# EAGLE design SparkFun_IR_Receiver (EAGLE 7.2.0)
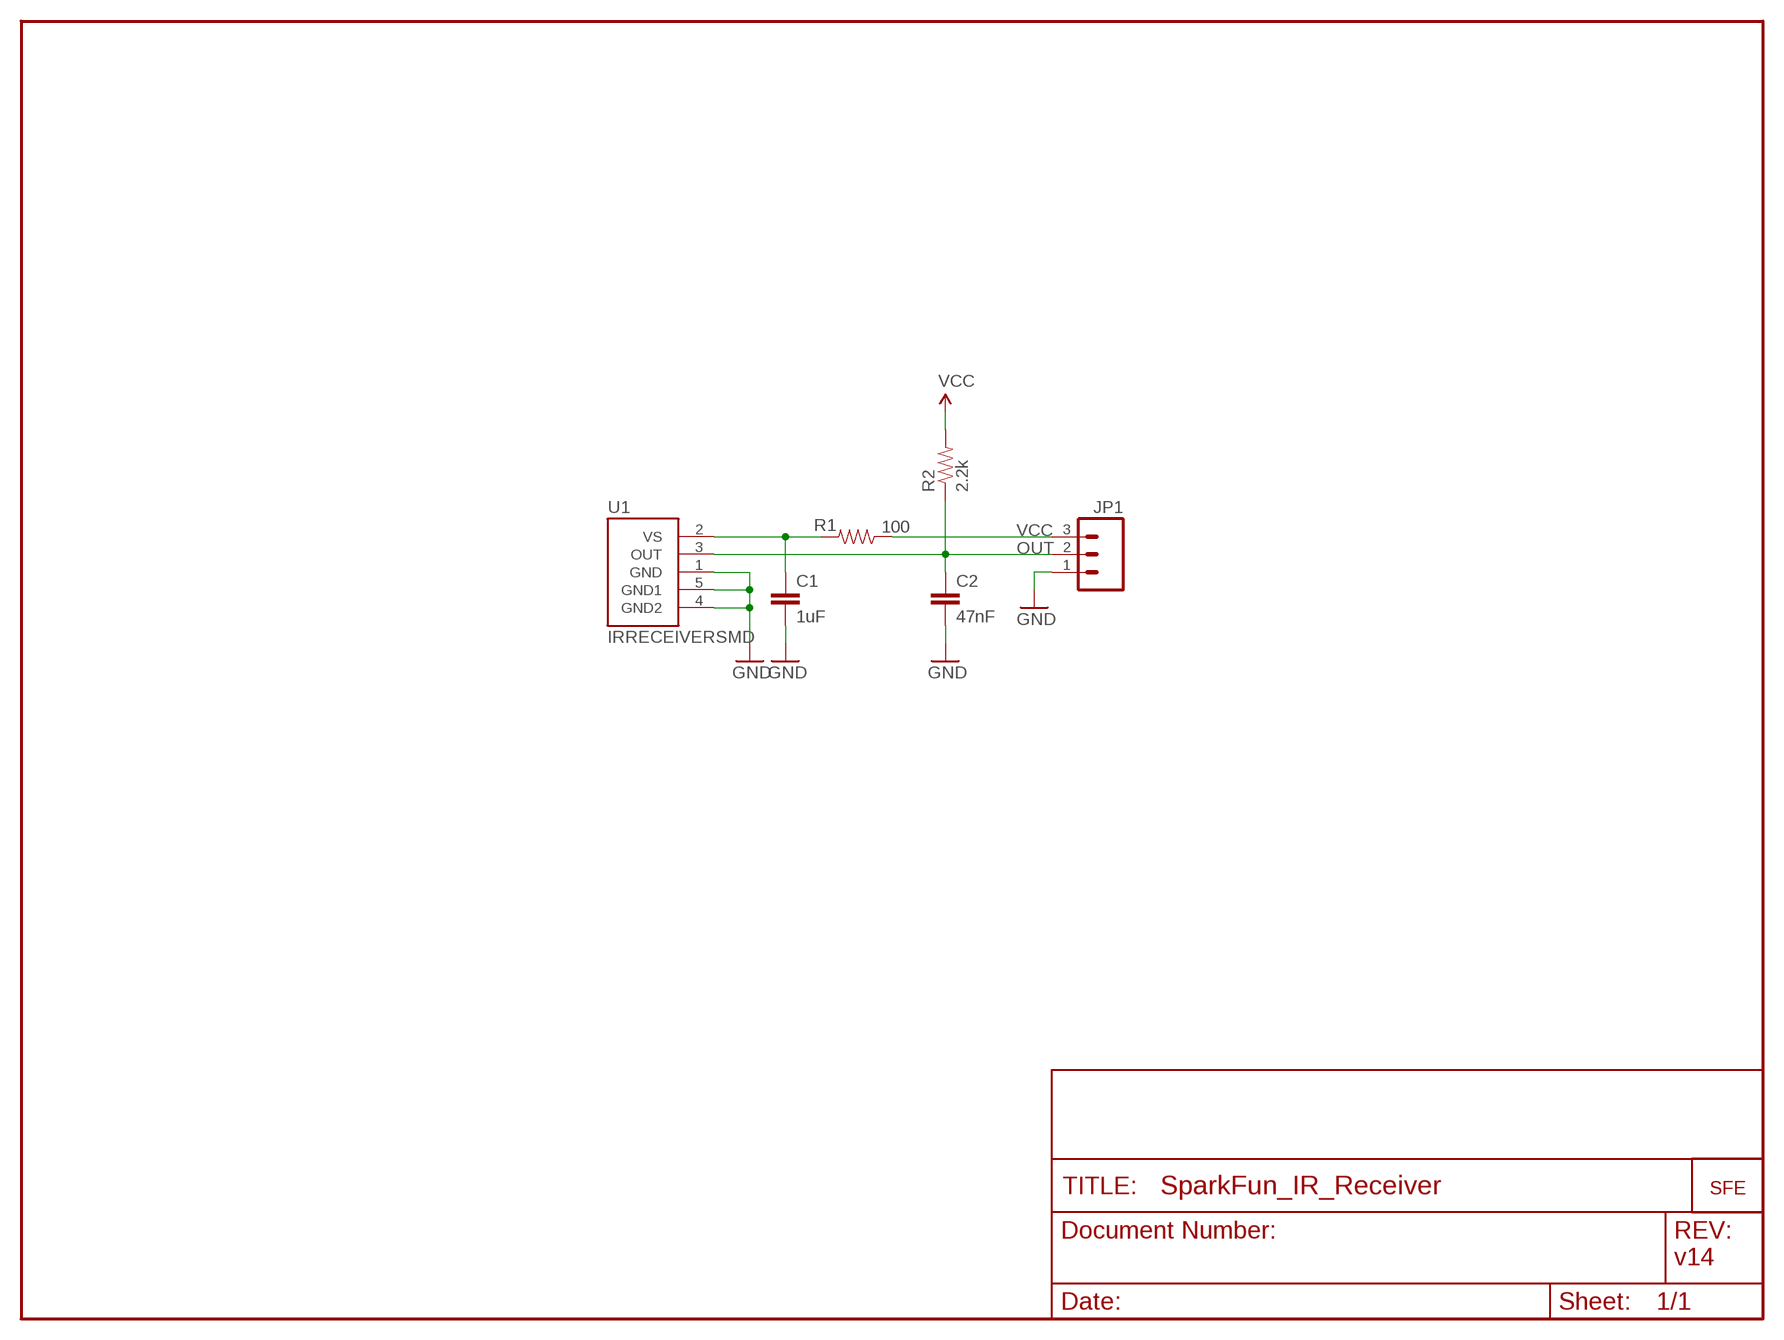
[diagram p0: schematic, sheet 1]

## Parts
C1  1uF  CAP0603-CAP  [0603-CAP]
C2  47nF  CAP0603-CAP  [0603-CAP]
JP1  M03PTH  [1X03]
R1  100  RESISTOR0603-RES  [0603-RES]
R2  2.2k  RESISTOR0603-RES  [0603-RES]
U1  IRRECEIVERSMD  [TSOP8523]
U$1  LOGO-SFESK  [SFE-LOGO-FLAME]

## Nets
GND: C1.2 C2.2 JP1.1 U1.1(GND) U1.4(GND2) U1.5(GND1)
OUT: C2.1 JP1.2 R2.1 U1.3(OUT)
VCC: JP1.3 R1.1 R2.2
VS: C1.1 R1.2 U1.2(VS)

## Notes on the sheet
- v14

## Library data of the parts
C1 C2 = SparkFun:CAP: Capacitor Standard 0603 ceramic capacitor, and 0.1" leaded capacitor.
JP1 = SparkFun:M03: Header 3 Standard 3-pin 0.1" header. Use with straight break away headers (SKU : PRT-00116), right angle break away headers (PRT-00553), swiss pins (PRT-00743), machine pins (PRT-00117), and female headers (PRT-00115). Molex polarized connector foot print use with SKU : PRT-08232 with associated crimp pins and housings.
R1 R2 = SparkFun:RESISTOR: Resistor Basic schematic elements and footprints for 0603, 1206, and PTH 1/10th watt (small) resistors.
U1 = SparkFun:IRRECEIVER: Description: IR receiver with built in demodulation and filtering. SparkFun SKU: SEN-08545
U$1 = SparkFun:LOGO-SFE: Spark Fun Electronics PCB Logo This is the standard Spark Fun Electronics PCB logo.

## Board
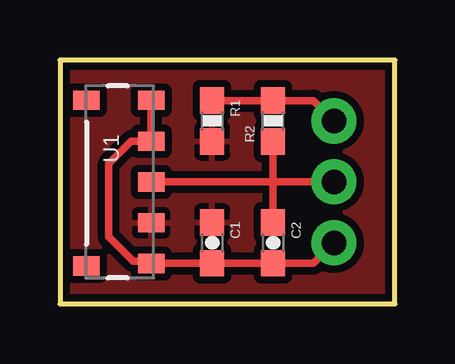
[diagram p1: board, top side]
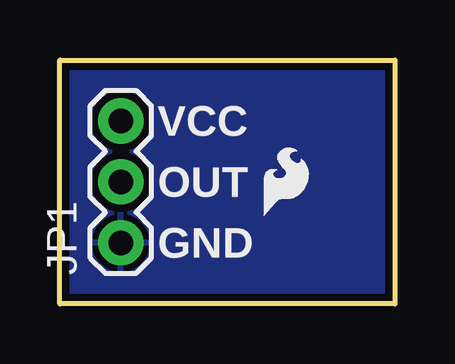
[diagram p2: board, bottom side, seen from below]

Size 13.97 x 10.16 mm. Coordinates in mm from the lower left corner, seen from the top.
Outline: 0,0 13.97,0 13.97,10.16 0,10.16 0,0
Copper layers (1*16): Top 0.035mm / dielectric 1.5mm / Bottom 0.035mm
Design rules "SparkFun": minimum track width 8mil, minimum drill 20mil, track to track 8mil, track to pad 8mil, pad to pad 8mil, via to via 8mil, smd to smd 8mil, copper to edge 8mil, drill to drill 8mil, minimum pad ring 12mil, minimum via ring 10mil, stop-mask expansion 4mil, vias tented up to drill 20mil, thermal gap 10mil

### Footprints (pad centres in the part's own frame; a part is rotated, then mirrored left to right if it is on the bottom)
0603-CAP = smd 1.1 x 1: 1 -0.85,0; 2 0.85,0
1X03 = drill 1.016 pad 1.88: 1 0,0; 2 2.54,0; 3 5.08,0
0603-RES = smd 1.1 x 1: 1 -0.85,0; 2 0.85,0
TSOP8523 = smd 0.8 x 1.1: 1 3.4,0; 2 1.7,0; 3 0,0; 4 -1.7,0; 5 -3.4,0; P$1 -3.4,-2.7; P$2 3.5,-2.7

### Placement (x,y rotation side)
C1  6.35,2.54 270 top
C2  8.89,2.54 270 top
JP1  11.43,2.54 90 bottom
R1  6.35,7.62 270 top
R2  8.89,7.62 90 top
U1  3.81,5.08 270 top
U$1  5.46,3.68 0 bottom

### Tracks (layer width: path | path; a pad name or v marks a point on that pad's centre or on a via)
GND
  Top 0.203: U1.1 3.81,1.78
  Top 0.305: U1.1 C1.2 C2.2 10.58,1.69 JP1.1 | 3.81,1.78 3.05,1.78 2.03,2.79 2.03,5.84 2.97,6.78 U1.4 U1.5
  pour Bottom (isolate 0.305): 0,10.16 0,0 13.97,0 13.97,10.16
OUT
  Top 0.203: C2.1 8.89,3.3
  Top 0.305: 8.89,5.08 C2.1 | 8.89,5.08 JP1.2 | 8.89,5.08 R2.1 | U1.3 8.89,5.08
VCC
  Top 0.305: R1.1 R2.2 10.58,8.47 JP1.3
VS
  pour Top (isolate 0.305): 0,10.16 0,0 13.97,0 13.97,10.16

### Text on the board
bPlace: VCC | OUT | GND